# Altium project 07-sistema-minimo-mcu.PrjPcb
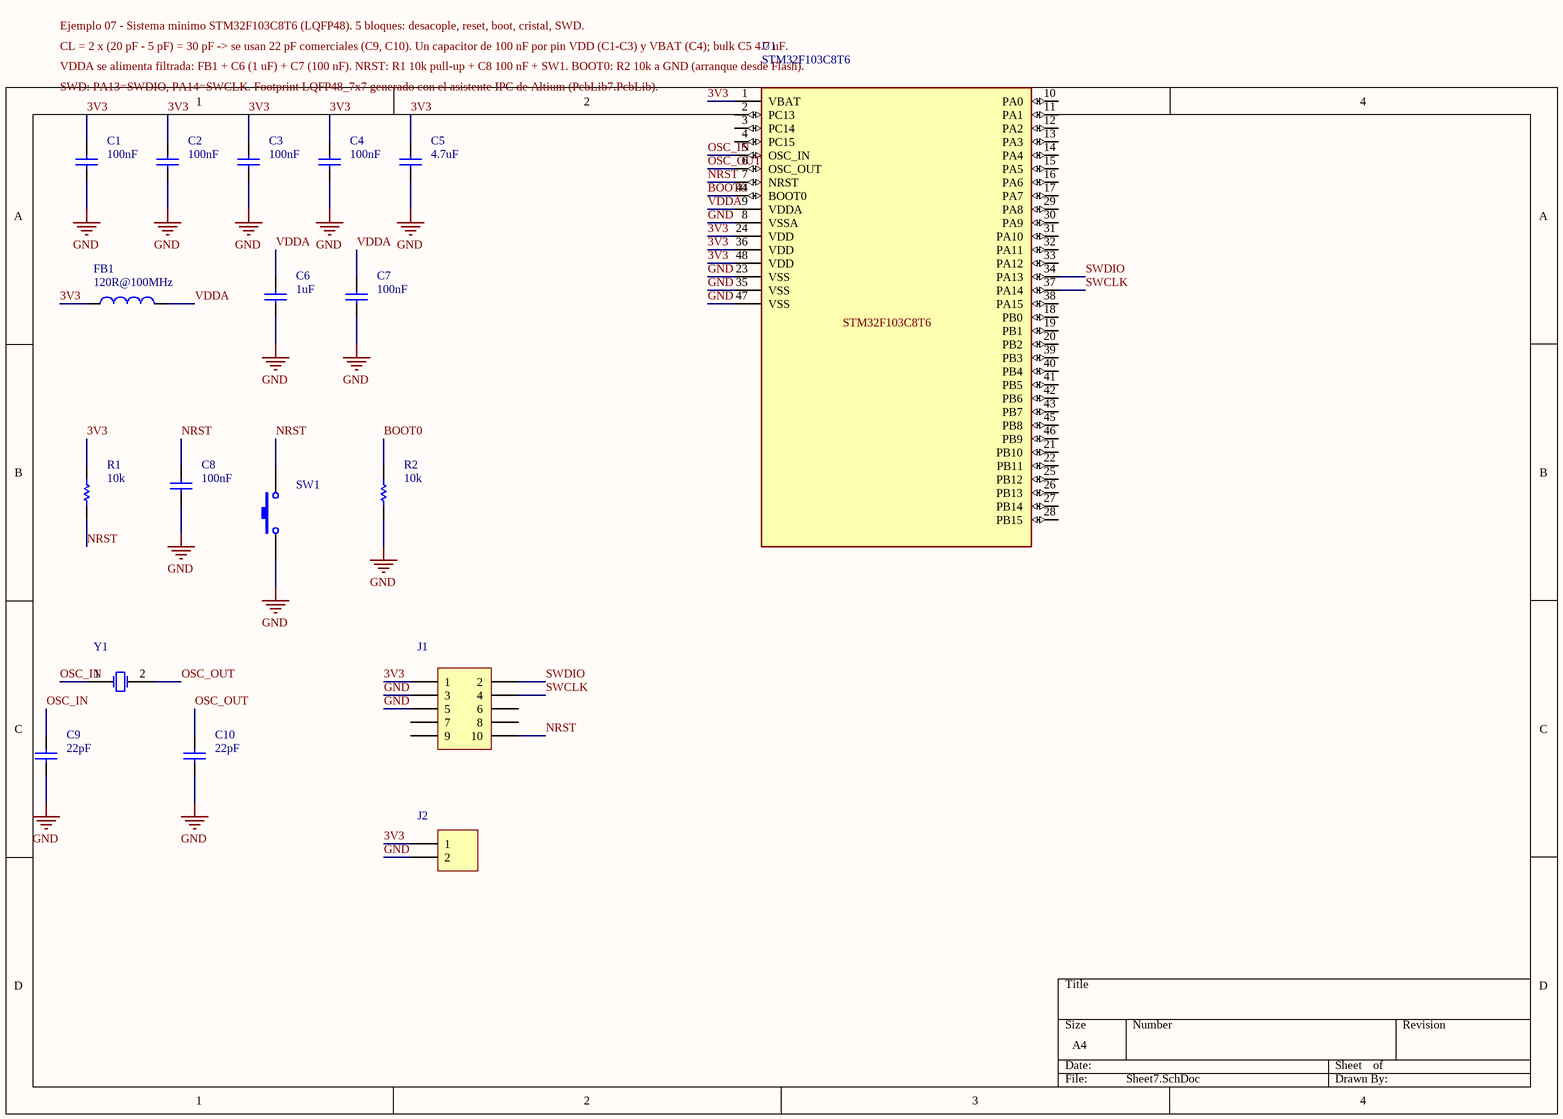
[diagram p0: Sheet7.SchDoc]
1 sheet, 18 parts. Net scope: global (net labels, ports and power ports of the same name join across sheets).
Board file: PCB7.PcbDoc

## Sheet Sheet7.SchDoc: Ejemplo 07: sistema minimo STM32F103C8T6 (LQFP48)
size A4; Author: Efrain Alvarado; CompanyName: Universidad de Cuenca - MCIE; DrawnBy: Efrain Alvarado; DocumentNumber: E07; Revision: 1.0; SheetNumber: 1; SheetTotal: 1

### Parts
C1  value 100nF  [0603]  (hidden comment: Cap)
C2  value 100nF  [0603]  (hidden comment: Cap)
C3  value 100nF  [0603]  (hidden comment: Cap)
C4  value 100nF  [0603]  (hidden comment: Cap)
C5  value 4.7uF  [C0805]  (hidden comment: Cap)
C6  value 1uF  [0603]  (hidden comment: Cap)
C7  value 100nF  [0603]  (hidden comment: Cap)
C8  value 100nF  [0603]  (hidden comment: Cap)
C9  value 22pF  [0603]  (hidden comment: Cap)
C10  value 22pF  [0603]  (hidden comment: Cap)
FB1  value 120R@100MHz  [0603]  (hidden comment: Inductor)
J1  Header 5X2  [HDR2X5]  (value not drawn)
J2  Header 2  [HDR1X2]  (value not drawn)
R1  value 10k  [0603]  (hidden comment: Res1)
R2  value 10k  [0603]  (hidden comment: Res1)
SW1  SW-PB  [SPST-2]  (value not drawn)
U1  STM32F103C8T6  [LQFP48_7x7]
Y1  XTAL  [R38]  (value not drawn)

### Nets
GND: C1.1 C2.1 C3.1 C4.1 C5.1 C6.1 C7.1 C8.1 C9.1 C10.1 J1.3 J1.5 J2.2 R2.1 SW1.1 U1.8(VSSA) U1.23(VSS) U1.35(VSS) U1.47(VSS)
3V3: C1.2 C2.2 C3.2 C4.2 C5.2 FB1.1 J1.1 J2.1 R1.2 U1.1(VBAT) U1.24(VDD) U1.36(VDD) U1.48(VDD)
BOOT0: R2.2 U1.44(BOOT0)
NRST: C8.2 J1.10 R1.1 SW1.2 U1.7(NRST)
OSC_IN: C9.2 U1.5(OSC_IN) Y1.1(OSC1)
OSC_OUT: C10.2 U1.6(OSC_OUT) Y1.2(OSC2)
SWCLK: J1.4 U1.37(PA14)
SWDIO: J1.2 U1.34(PA13)
VDDA: C6.2 C7.2 FB1.2 U1.9(VDDA)

Not connected (* = marked no-connect by the designer): J1 6 7 8 9; U1 2(PC13) 3(PC14) 4(PC15) 10(PA0) 11(PA1) 12(PA2) 13(PA3) 14(PA4) 15(PA5) 16(PA6) 17(PA7) 18(PB0) 19(PB1) 20(PB2) 21(PB10) 22(PB11) 25(PB12) 26(PB13) 27(PB14) 28(PB15) 29(PA8) 30(PA9) 31(PA10) 32(PA11) 33(PA12) 38(PA15) 39(PB3) 40(PB4) 41(PB5) 42(PB6) 43(PB7) 45(PB8) 46(PB9)

### Notes on the sheet
- Ejemplo 07 - Sistema minimo STM32F103C8T6 (LQFP48). 5 bloques: desacople, reset, boot, cristal, SWD.
- (near U1) CL = 2 x (20 pF - 5 pF) = 30 pF -> se usan 22 pF comerciales (C9, C10). Un capacitor de 100 nF por pin VDD (C1-C3) y VBAT (C4); bulk C5 4.7 uF.
- (near U1) VDDA se alimenta filtrada: FB1 + C6 (1 uF) + C7 (100 nF). NRST: R1 10k pull-up + C8 100 nF + SW1. BOOT0: R2 10k a GND (arranque desde Flash).
- SWD: PA13=SWDIO, PA14=SWCLK. Footprint LQFP48_7x7 generado con el asistente IPC de Altium (PcbLib7.PcbLib).

### Library data of the parts
C1-C4 = Cap: Capacitor 100 nF 0603 (desacople VDD/VBAT); Manufacturer: KEMET; Manufacturer Part Number: C0603C104K5RACTU; Published: 8-Jun-2000; LatestRevisionDate: 17-Jul-2002; LatestRevisionNote: Re-released for DXP Platform.; PackageReference: RAD-0.3; Publisher: Altium Limited; PackageDescription: Radial Cap, Thru-Hole; 2 Leads; 0.3 in Pin Spacing
C5 = Cap: Capacitor 4.7 uF 0805 (bulk); Manufacturer: KEMET; Manufacturer Part Number: C0805C475K8PACTU; Published: 8-Jun-2000; LatestRevisionDate: 17-Jul-2002; LatestRevisionNote: Re-released for DXP Platform.; PackageReference: RAD-0.3; Publisher: Altium Limited; PackageDescription: Radial Cap, Thru-Hole; 2 Leads; 0.3 in Pin Spacing
C6 = Cap: Capacitor 1 uF 0603 (VDDA); Manufacturer: KEMET; Manufacturer Part Number: C0603C105K8RACTU; Published: 8-Jun-2000; LatestRevisionDate: 17-Jul-2002; LatestRevisionNote: Re-released for DXP Platform.; PackageReference: RAD-0.3; Publisher: Altium Limited; PackageDescription: Radial Cap, Thru-Hole; 2 Leads; 0.3 in Pin Spacing
C7 = Cap: Capacitor 100 nF 0603 (VDDA); Manufacturer: KEMET; Manufacturer Part Number: C0603C104K5RACTU; Published: 8-Jun-2000; LatestRevisionDate: 17-Jul-2002; LatestRevisionNote: Re-released for DXP Platform.; PackageReference: RAD-0.3; Publisher: Altium Limited; PackageDescription: Radial Cap, Thru-Hole; 2 Leads; 0.3 in Pin Spacing
C8 = Cap: Capacitor 100 nF 0603 (filtro NRST); Manufacturer: KEMET; Manufacturer Part Number: C0603C104K5RACTU; Published: 8-Jun-2000; LatestRevisionDate: 17-Jul-2002; LatestRevisionNote: Re-released for DXP Platform.; PackageReference: RAD-0.3; Publisher: Altium Limited; PackageDescription: Radial Cap, Thru-Hole; 2 Leads; 0.3 in Pin Spacing
C9 C10 = Cap: Capacitor 22 pF 0603 (carga cristal); Manufacturer: KEMET; Manufacturer Part Number: C0603C220J5GACTU; Published: 8-Jun-2000; LatestRevisionDate: 17-Jul-2002; LatestRevisionNote: Re-released for DXP Platform.; PackageReference: RAD-0.3; Publisher: Altium Limited; PackageDescription: Radial Cap, Thru-Hole; 2 Leads; 0.3 in Pin Spacing
FB1 = Inductor: Ferrite bead 120 ohm @100 MHz 0603 (VDD -> VDDA); Manufacturer: Murata; Manufacturer Part Number: BLM18PG121SN1D; Code_IEC: 1005; Published: 8-Jun-2000; LatestRevisionDate: 29-May-2009; LatestRevisionNote: IPC-7351 Footprint Added.; PackageReference: 0402-A; Publisher: Altium Limited; PackageDescription: Chip Inductor; Code_JEITA: 0402
J1 = Header 5X2: Header 2x5 SWD: 3V3, SWDIO, SWCLK, GND, NRST; Manufacturer: Generic; Manufacturer Part Number: Pin header 2x5 2.54 mm; LatestRevisionDate: 17-Jul-2002; LatestRevisionNote: Re-released for DXP Platform.; Publisher: Altium Limited
J2 = Header 2: Header 2 pin: alimentacion 3V3 y GND; Manufacturer: Generic; Manufacturer Part Number: Pin header 1x2; LatestRevisionDate: 17-Jul-2002; LatestRevisionNote: Re-released for DXP Platform.; Publisher: Altium Limited
R1 = Res1: Resistor 10 kohm 0603 (pull-up NRST); Manufacturer: Yageo; Manufacturer Part Number: RC0603FR-0710KL; Published: 8-Jun-2000; LatestRevisionDate: 17-Jul-2002; LatestRevisionNote: Re-released for DXP Platform.; PackageReference: AXIAL-0.3; Publisher: Altium Limited; PackageDescription: Axial Device, Thru-Hole; 2 Leads; 0.3 in Pin Spacing
R2 = Res1: Resistor 10 kohm 0603 (pull-down BOOT0); Manufacturer: Yageo; Manufacturer Part Number: RC0603FR-0710KL; Published: 8-Jun-2000; LatestRevisionDate: 17-Jul-2002; LatestRevisionNote: Re-released for DXP Platform.; PackageReference: AXIAL-0.3; Publisher: Altium Limited; PackageDescription: Axial Device, Thru-Hole; 2 Leads; 0.3 in Pin Spacing
SW1 = SW-PB: Pulsador de reset; Manufacturer: Generic; Manufacturer Part Number: Tactile 6x6; Published: 24-Mar-1999; LatestRevisionDate: 17-Jul-2002; LatestRevisionNote: Re-released for DXP Platform.; PackageReference: SPST-2; Publisher: Altium Limited; PackageDescription: Switch; 2 Leads
U1 = STM32F103C8T6: STM32F103C8T6 ARM Cortex-M3 72 MHz, 64 kB Flash, 20 kB RAM, LQFP48; Manufacturer: STMicroelectronics; Manufacturer Part Number: STM32F103C8T6
Y1 = XTAL: Crystal 8 MHz, CL=20 pF; Manufacturer: Abracon; Manufacturer Part Number: ABL-8.000MHZ-B2; Published: 8-Jun-2000; LatestRevisionDate: 17-Jul-2002; LatestRevisionNote: Re-released for DXP Platform.; PackageReference: R38; Publisher: Altium Limited; PackageDescription: Crystal, Thru-Hole; 2 Leads; Body 3.1 x 8.2 mm (Dia.xH)